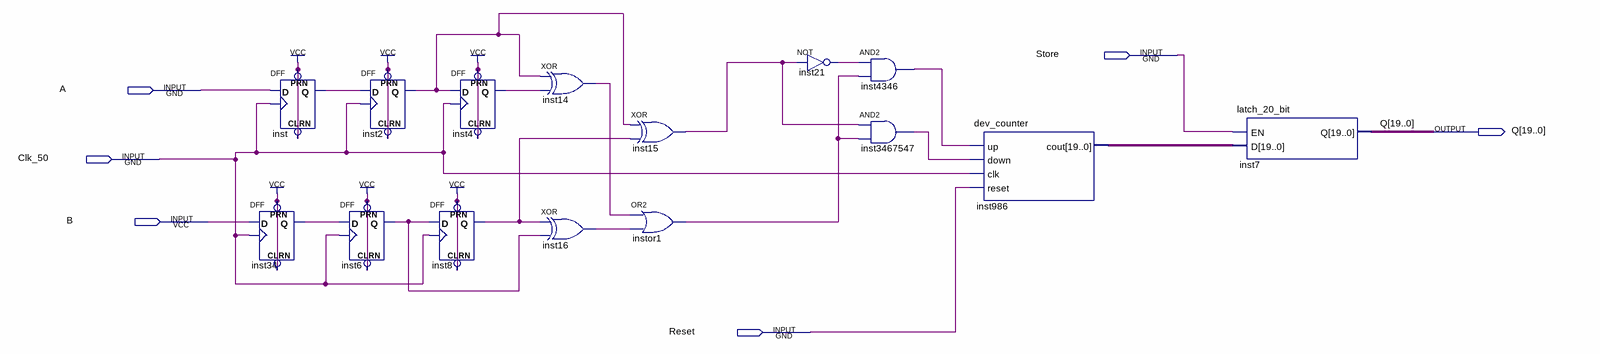
[diagram p0: schematic sheet]
// Quartus schematic enc_counter.bdf as structural Verilog: 15 symbols, 6 pins
module enc_counter (
  input  Store,
  input  A,
  input  Clk_50,
  input  B,
  input  Reset,
  output [19:0] Q
);

  wire inst2_q, inst4_q, inst6_q, inst8_q, inst14_out, inst15_out, inst16_out, inst21_out, inst34_q,
       inst4346_out, inst3467547_out, inst_q, instor1_out;
  wire [19:0] inst986_cout;

  DFF inst34 (.CLRN(1'b1), .CLK(Clk_50), .D(B), .PRN(1'b1), .Q(inst34_q));
  DFF inst (.CLRN(1'b1), .CLK(Clk_50), .D(A), .PRN(1'b1), .Q(inst_q));
  DFF inst2 (.CLRN(1'b1), .CLK(Clk_50), .D(inst_q), .PRN(1'b1), .Q(inst2_q));
  DFF inst6 (.CLRN(1'b1), .CLK(Clk_50), .D(inst34_q), .PRN(1'b1), .Q(inst6_q));
  DFF inst4 (.CLRN(1'b1), .CLK(Clk_50), .D(inst2_q), .PRN(1'b1), .Q(inst4_q));
  DFF inst8 (.CLRN(1'b1), .CLK(Clk_50), .D(inst6_q), .PRN(1'b1), .Q(inst8_q));
  xor inst14 (inst14_out, inst2_q, inst4_q);
  xor inst16 (inst16_out, inst8_q, inst6_q);
  xor inst15 (inst15_out, inst2_q, inst8_q);
  or instor1 (instor1_out, inst14_out, inst16_out);
  not inst21 (inst21_out, inst15_out);
  and inst4346 (inst4346_out, inst21_out, instor1_out);
  and inst3467547 (inst3467547_out, inst15_out, instor1_out);
  dev_counter inst986 (.up(inst4346_out), .down(inst3467547_out), .clk(Clk_50), .reset(Reset), .cout(inst986_cout));
  latch_20_bit inst7 (.EN(Store), .D(inst986_cout), .Q(Q));
endmodule
